# EAGLE schematic LCM_BlowerHW (EAGLE 9.4.2)
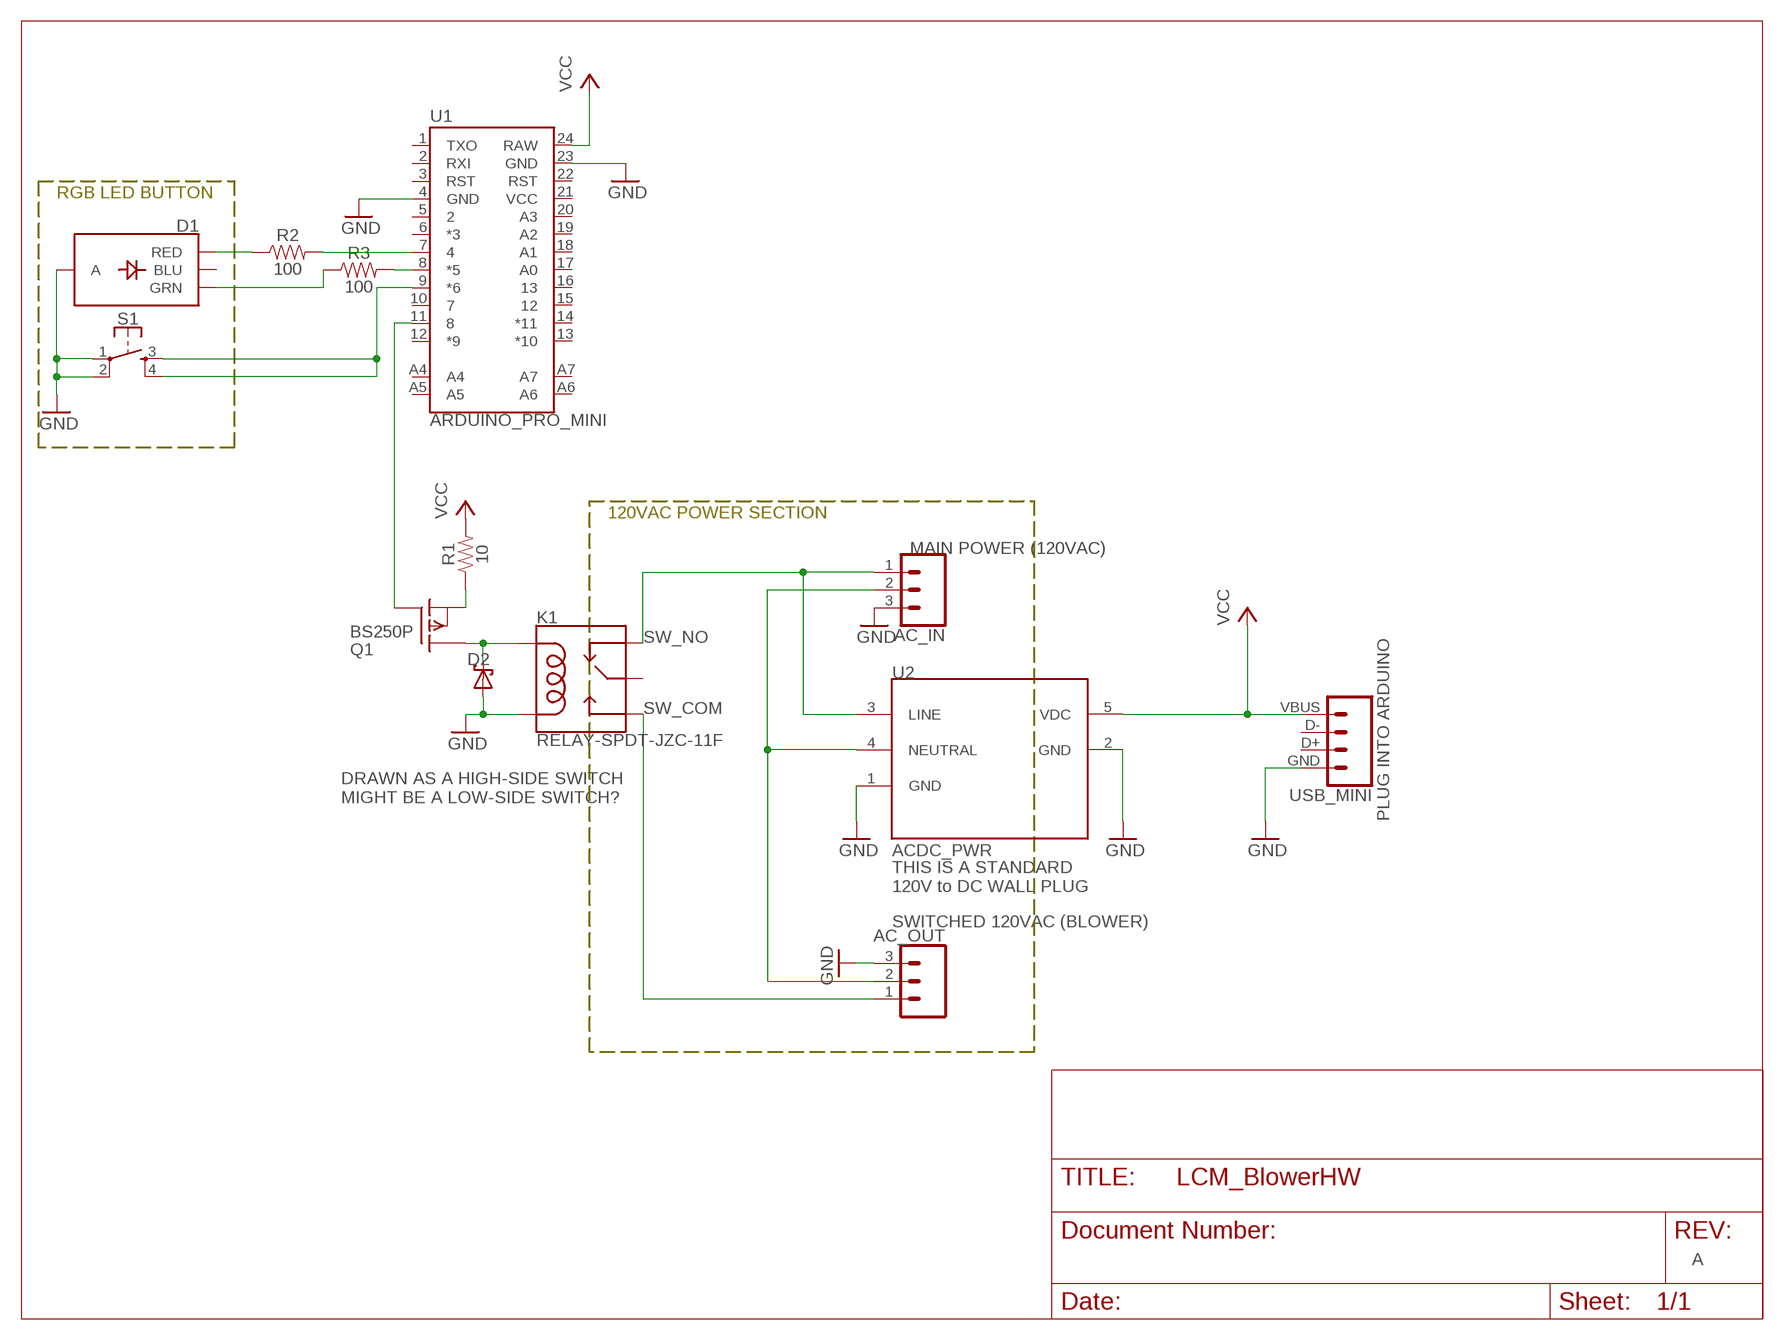
[diagram p0: schematic, sheet 1]
FRAME1 (LETTER_L): REV: A

## Parts
AC_IN  CONN_03SCREW  [SCREWTERMINAL-3.5MM-3]
AC_OUT  CONN_03SCREW  [SCREWTERMINAL-3.5MM-3]
D1  CLEAR  LED-RGB-CACLEAR  [LED-RGB-THRU]
D2  SCHOTTKY-DIODEDO41-7  [DO41-7]
K1  RELAY-SPDT-JZC-11F  [RELAY-JZC]
Q1  BS250P  BSS110  [TO92]
R1  10  10OHM-HORIZ-1/4W-1%  [AXIAL-0.3]
R2  100  100OHM-HORIZ-1/4W-1%  [AXIAL-0.3]
R3  100  100OHM-HORIZ-1/4W-1%  [AXIAL-0.3]
S1  MOMENTARY-SWITCH-SPST-2-SMD-5.2MM  [TACTILE_SWITCH_SMD_5.2MM]
U1  ARDUINO_PRO_MINI  [ARDUINO_PRO_MINI]
U2  ACDC_PWR  [SO08]
USB_MINI  USB_SOLDER_PADS  [USB-SOLDER-PADS]

## Nets
GND: AC_IN.3 AC_OUT.3 D1.2(A) D2.A K1.1(COIL2) S1.1 S1.2 U1.4(GND) U1.23(GND) U2.1(GND) U2.2(GND) USB_MINI.GND
N$1: Q1.1(S) R1.P$1
N$2: AC_IN.2 AC_OUT.2 U2.4(NEUTRAL)
N$3: D2.C K1.5(COIL1) Q1.3(D)
N$4: D1.1(RED) R2.P$1
N$5: R2.P$2 U1.7
N$6: R3.P$2 U1.8(*5)
N$7: D1.3(GRN) R3.P$1
N$8: S1.3 S1.4 U1.9(*6)
N$9: Q1.2(G) U1.11
SW_COM: AC_OUT.1 K1.3(NO)
SW_NO: AC_IN.1 K1.2(NC) U2.3(LINE)
VCC: R1.P$2 U1.24(RAW) U2.5(VDC) USB_MINI.VBUS
Unconnected: D1.4(BLU) K1.4(MAIN) U1.1(TXO) U1.2(RXI) U1.3(RST) U1.5 U1.6(*3) U1.10 U1.12(*9) U1.13(*10) U1.14(*11) U1.15 U1.16 U1.17(A0) U1.18(A1) U1.19(A2) U1.20(A3) U1.22(RST) U1.A4 U1.A5 U1.A6 U1.A7 USB_MINI.D+ USB_MINI.D-

## Notes on the sheet
- RGB LED BUTTON
- 120VAC POWER SECTION
- MAIN POWER (120VAC)
- DRAWN AS A HIGH-SIDE SWITCH
  MIGHT BE A LOW-SIDE SWITCH?
- PLUG INTO ARDUINO
- THIS IS A STANDARD
  120V to DC WALL PLUG
- SWITCHED 120VAC (BLOWER)

## Power pins joined to a net without a drawn wire
VCC: U1.21(VCC)

## Library data of the parts
AC_IN AC_OUT = SparkFun-Connectors:CONN_03: Multi connection point. Often used as Generic Header-pin footprint for 0.1 inch spaced/style header connections On any of the 0.1 inch spaced packages, you can populate with these: Break Away Headers - Straight <https://www.sparkfun.com/products/116> (PRT-00116) Break Away Male Headers - Right Angle <https://www.sparkfun.com/products/553> (PRT-00553) Female Headers <https://www.sparkfun.com/products/115> (PRT-00115) Break Away Headers - Machine Pin <https://www.sparkfun.com/products/117> (PRT-00117) Break Away Female Headers - Swiss Machine Pin <https://www.sparkfun.com/products/743> (PRT-00743) Stackable Header - 3 Pin (Female, 0.1") <https://www.sparkfun.com/products/13875> (PRT-13875) For SCREWTERMINALS and SPRING TERMINALS visit here: Screw Terimnals on SparkFun.com <https://www.sparkfun.com/search/results?term=Screw+Terminals> (5mm/3.5mm/2.54mm spacing) This device is also useful as a general connection point to wire up your design to another part of your project. Our various solder wires solder well into these plated through hole pads. Hook-Up Wire - Assortment (Stranded, 22 AWG) <https://www.sparkfun.com/products/11375> (PRT-11375) Hook-Up Wire - Assortment (Solid Core, 22 AWG) <https://www.sparkfun.com/products/11367> (PRT-11367) View the entire wire category on our website here <https://www.sparkfun.com/categories/141> Special notes: Molex polarized connector foot print use with SKU : PRT-08232 with associated crimp pins and housings.; PROD_ID: CONN-08288; SF_ID: PRT-08235
D1 = SparkFun-LED:LED-RGB-CA: LED-RGB Diffused Common Anode Packages: LED RGB-THRU P-LCC-4-3 LED-TRICOLOR-SMD SparkFun Products: RGB Diffused Common Anode- Diffuse <[https://www.sparkfun.com/products/10821]> RGB Diffused Common Anode - Clear <[https://www.sparkfun.com/products/10820]> Qduino Mini <[https://www.sparkfun.com/products/13614]> Triple Output LED RGB - SMD <https://www.sparkfun.com/products/7844>; PROD_ID: DIO-10631
D2 = adafruit:SCHOTTKY-DIODE: Schottky Diode
K1 = SparkFun-Electromechanical:RELAY-SPDT: SPDT Electromechanical Relay Single-pole, double-throw sealed relays. When current is applied to the coil, it throws a simple changeover switch, terminating the connection from the NC contact to ground and closing the NO contact. Use them to switch high voltage/high current devices. SparkFun Products JQX-15F: Relay SPDT Sealed - 20A <https://www.sparkfun.com/products/10924> (COM-10924) JZC-11F: Relay SPDT Sealed <https://www.sparkfun.com/products/100> (COM-00100); PROD_ID: COMP-09533; SF_SKU: COM-00100
Q1 = transistor-fet:BSS110: P-Channel Enhancement MOSFET -50V; -0,17A; 6Ohm
R1 = SparkFun-Resistors:10OHM: 10Ω resistor A resistor is a passive two-terminal electrical component that implements electrical resistance as a circuit element. Resistors act to reduce current flow, and, at the same time, act to lower voltage levels within circuits. - Wikipedia; PROD_ID: RES-12180
R2 R3 = SparkFun-Resistors:100OHM: 100Ω resistor A resistor is a passive two-terminal electrical component that implements electrical resistance as a circuit element. Resistors act to reduce current flow, and, at the same time, act to lower voltage levels within circuits. - Wikipedia; PROD_ID: RES-12181
S1 = SparkFun-Switches:MOMENTARY-SWITCH-SPST-2: Momentary Switch (Pushbutton) - SPST - Two Circuits Normally-open (NO) SPST momentary switches (buttons, pushbuttons). Schematic symbol includes two switch circuits. Variants SMD-4.6MMX2.8MM - 4.60mm x 2.80mm Tactile Momentary Button Switch - Used on SparkFun SAMD21 Mini Breakout <https://www.sparkfun.com/products/13664> SMD-5.2MM - Mini Pushbutton Switch - SMD <https://www.sparkfun.com/products/8720> - Used on Arduino Pro Mini <https://www.sparkfun.com/products/11114>; PROD_ID: SWCH-08247; SF_SKU: COM-08720
U1 = SparkFun-Boards:ARDUINO_PRO_MINI: SparkFun Pro Mini Pro Mini compatible footprint. Dimensions: 0.7 x 1.3" PCB Thickness: 0.8mm SparkFun Products: 3.3V/8MHz <https://www.sparkfun.com/products/11114> 5V/16MHz <https://www.sparkfun.com/products/11113>
U2 = 570labs:ACDC_PWR
USB_MINI = SparkFun-Connectors:USB_SOLDER_PADS: Solder pad access to USB pins. Helpful to expose on PCBs so user can attach external USB connector if necessary.